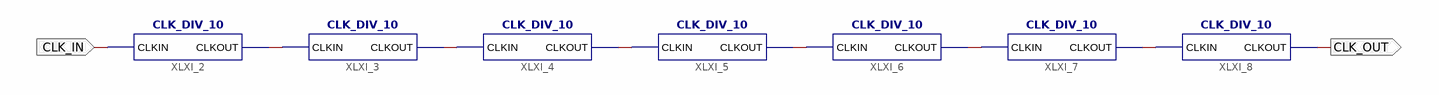
[diagram p0: schematic sheet 1]
// Xilinx ISE schematic CLK_DIV_10M.sch (spartan6) as structural Verilog: 7 symbols, 2 ports
module CLK_DIV_10M (
  input  CLK_IN,
  output CLK_OUT
);

  wire XLXN_1, XLXN_2, XLXN_3, XLXN_4, XLXN_5, XLXN_6;

  CLK_DIV_10 XLXI_2 (.CLKIN(CLK_IN), .CLKOUT(XLXN_1));
  CLK_DIV_10 XLXI_3 (.CLKIN(XLXN_1), .CLKOUT(XLXN_2));
  CLK_DIV_10 XLXI_4 (.CLKIN(XLXN_2), .CLKOUT(XLXN_3));
  CLK_DIV_10 XLXI_5 (.CLKIN(XLXN_3), .CLKOUT(XLXN_4));
  CLK_DIV_10 XLXI_6 (.CLKIN(XLXN_4), .CLKOUT(XLXN_5));
  CLK_DIV_10 XLXI_7 (.CLKIN(XLXN_5), .CLKOUT(XLXN_6));
  CLK_DIV_10 XLXI_8 (.CLKIN(XLXN_6), .CLKOUT(CLK_OUT));
endmodule
